# Altium schematic sheet mcu.SchDoc
size A3
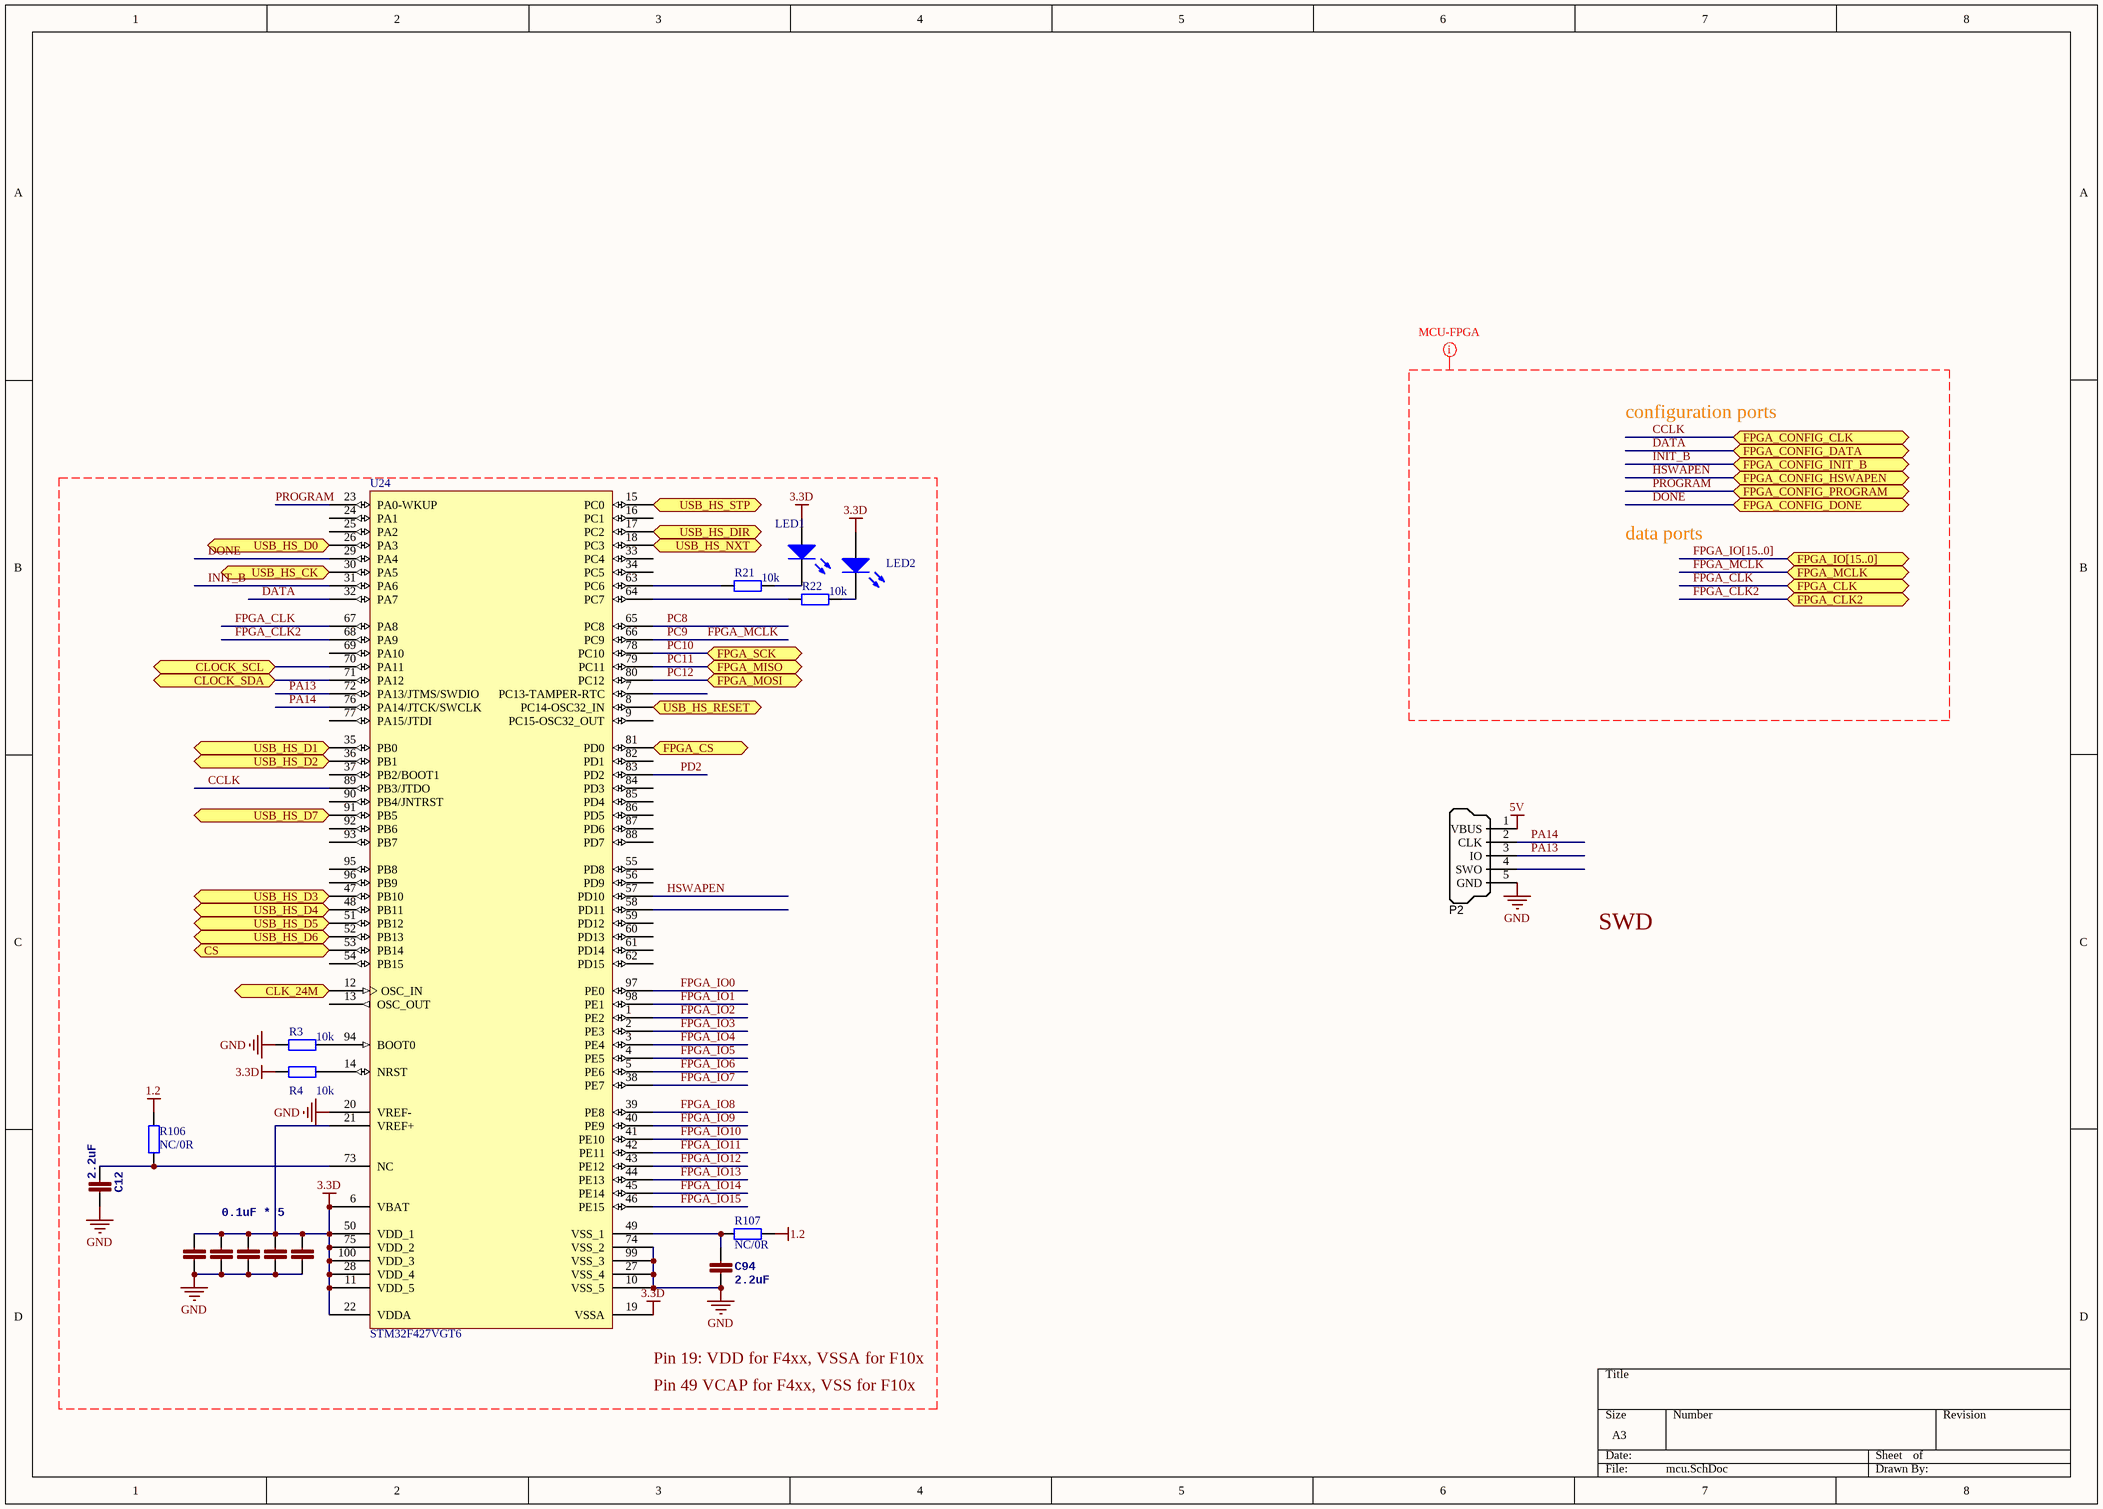
[diagram p0: mcu.SchDoc]

## Parts
C4  0.1uF * 5  [0402]
C5  1n  [0402]  (value not drawn)
C6  1n  [0402]  (value not drawn)
C10  1n  [0402]  (value not drawn)
C12  2.2uF  [0603]
C25  1n  [0402]  (value not drawn)
C94  2.2uF  [0603]
LED1  LED0  [0603]  (value not drawn)
LED2  LED0  [0603]  (value not drawn)
P2  SWD_MicroUSB  [MICRO-YZX]  (value not drawn)
R3  10k  [0402]
R4  10k  [0402]
R21  10k  [0402]
R22  10k  [0402]
R106  NC/0R  [0402]
R107  NC/0R  [0402]
U24  STM32F427VGT6  [LQFP100_N]

## Ports
CLK_24M, CLOCK_SCL, CLOCK_SDA, CS, FPGA_CLK, FPGA_CLK2, FPGA_CONFIG_CLK, FPGA_CONFIG_DATA, FPGA_CONFIG_DONE, FPGA_CONFIG_HSWAPEN, FPGA_CONFIG_INIT_B, FPGA_CONFIG_PROGRAM, FPGA_CS, FPGA_IO[15..0], FPGA_MCLK, FPGA_MISO, FPGA_MOSI, FPGA_SCK, USB_HS_CK, USB_HS_D0, USB_HS_D1, USB_HS_D2, USB_HS_D3, USB_HS_D4, USB_HS_D5, USB_HS_D6, USB_HS_D7, USB_HS_DIR, USB_HS_NXT, USB_HS_RESET, USB_HS_STP

## Nets
1.2: R106.1 R107.1
3.3D: C4.2 C5.2 C6.2 C10.2 C25.2 LED1.1(A) LED2.1(A) R4.2 U24.6(VBAT) U24.11(VDD_5) U24.19(VSSA) U24.21(VREF+) U24.22(VDDA) U24.28(VDD_4) U24.50(VDD_1) U24.75(VDD_2) U24.100(VDD_3)
5V: P2.1(VBUS)
GND: C4.1 C5.1 C6.1 C10.1 C12.1 C25.1 C94.1 P2.5(GND) R3.1 U24.10(VSS_5) U24.20(VREF-) U24.27(VSS_4) U24.74(VSS_2) U24.99(VSS_3)
CCLK: U24.89(PB3/JTDO) ; port FPGA_CONFIG_CLK
CLK_24M: U24.12(OSC_IN) ; port CLK_24M
CLOCK_SCL: U24.70(PA11) ; port CLOCK_SCL
CLOCK_SDA: U24.71(PA12) ; port CLOCK_SDA
CS: U24.53(PB14) ; port CS
DATA: U24.32(PA7) ; port FPGA_CONFIG_DATA
DONE: U24.29(PA4) ; port FPGA_CONFIG_DONE
FPGA_CLK: U24.67(PA8) ; port FPGA_CLK
FPGA_CLK2: U24.68(PA9) ; port FPGA_CLK2
FPGA_CS: U24.81(PD0) ; port FPGA_CS
FPGA_IO0: U24.97(PE0)
FPGA_IO1: U24.98(PE1)
FPGA_IO2: U24.1(PE2)
FPGA_IO3: U24.2(PE3)
FPGA_IO4: U24.3(PE4)
FPGA_IO5: U24.4(PE5)
FPGA_IO6: U24.5(PE6)
FPGA_IO7: U24.38(PE7)
FPGA_IO8: U24.39(PE8)
FPGA_IO9: U24.40(PE9)
FPGA_IO10: U24.41(PE10)
FPGA_IO11: U24.42(PE11)
FPGA_IO12: U24.43(PE12)
FPGA_IO13: U24.44(PE13)
FPGA_IO14: U24.45(PE14)
FPGA_IO15: U24.46(PE15)
FPGA_MCLK: U24.66(PC9) ; port FPGA_MCLK  [also labelled PC9]
HSWAPEN: U24.57(PD10) ; port FPGA_CONFIG_HSWAPEN
INIT_B: U24.31(PA6) ; port FPGA_CONFIG_INIT_B
PA13: P2.3(IO) U24.72(PA13/JTMS/SWDIO)
PA14: P2.2(CLK) U24.76(PA14/JTCK/SWCLK)
PC8: U24.65(PC8)
PC10: U24.78(PC10) ; port FPGA_SCK
PC11: U24.79(PC11) ; port FPGA_MISO
PC12: U24.80(PC12) ; port FPGA_MOSI
PD2: U24.83(PD2)
PROGRAM: U24.23(PA0-WKUP) ; port FPGA_CONFIG_PROGRAM
USB_HS_CK: U24.30(PA5) ; port USB_HS_CK
USB_HS_D0: U24.26(PA3) ; port USB_HS_D0
USB_HS_D1: U24.35(PB0) ; port USB_HS_D1
USB_HS_D2: U24.36(PB1) ; port USB_HS_D2
USB_HS_D3: U24.47(PB10) ; port USB_HS_D3
USB_HS_D4: U24.48(PB11) ; port USB_HS_D4
USB_HS_D5: U24.51(PB12) ; port USB_HS_D5
USB_HS_D6: U24.52(PB13) ; port USB_HS_D6
USB_HS_D7: U24.91(PB5) ; port USB_HS_D7
USB_HS_DIR: U24.17(PC2) ; port USB_HS_DIR
USB_HS_NXT: U24.18(PC3) ; port USB_HS_NXT
USB_HS_RESET: U24.8(PC14-OSC32_IN) ; port USB_HS_RESET
USB_HS_STP: U24.15(PC0) ; port USB_HS_STP
NetC12_2: C12.2 R106.2 U24.73(NC)
NetC94_2: C94.2 R107.2 U24.49(VSS_1)
NetLED1_2: LED1.2(K) R21.2
NetLED2_2: LED2.2(K) R22.2
NetR3_2: R3.2 U24.94(BOOT0)
NetR4_1: R4.1 U24.14(NRST)
NetR21_1: R21.1 U24.63(PC6)
NetR22_1: R22.1 U24.64(PC7)

Not connected (* = marked no-connect by the designer): P2 4(SWO); U24 7(PC13-TAMPER-RTC) 9(PC15-OSC32_OUT) 13(OSC_OUT) 16(PC1) 24(PA1) 25(PA2) 33(PC4) 34(PC5) 37(PB2/BOOT1) 54(PB15) 55(PD8) 56(PD9) 58(PD11) 59(PD12) 60(PD13) 61(PD14) 62(PD15) 69(PA10) 77(PA15/JTDI) 82(PD1) 84(PD3) 85(PD4) 86(PD5) 87(PD6) 88(PD7) 90(PB4/JNTRST) 92(PB6) 93(PB7) 95(PB8) 96(PB9)

## Buses and harness runs
bus FPGA_IO[15..0] = port FPGA_IO[15..0]

## Layout directives
net class MCU-FPGA: CCLK, DATA, DONE, FPGA_CLK, FPGA_CLK2, FPGA_IO[15..0], FPGA_MCLK, HSWAPEN, INIT_B, PROGRAM

## Notes on the sheet
- configuration ports
- data ports
- SWD
- Pin 19: VDD for F4xx, VSSA for F10x
- Pin 49 VCAP for F4xx, VSS for F10x

## Library data of the parts
C4-C6 C10 C12 C25 C94 = CAP0402-CAP: <b>Capacitor</b> / Standard 0603 ceramic capacitor, and 0.1" leaded capacitor.; PARTNO: CC0402ZRY5V7BB104
LED1 LED2 = LED0: Typical INFRARED GaAs LED; Published: 8-Jun-2000; LatestRevisionDate: 08-Jul-2005; LatestRevisionNote: Mech Layer 1 removed.; PackageReference: LED-0; Publisher: Altium Limited; PackageDescription: LED; 2 Leads
P2 = SWD_MicroUSB: Connector SMD USB Micro Type B middle mount; Manufacturer 1: Molex Inc; SCDType: undef; Package / Case: SMD; Supplier 1: Digi-Key; Supplier Part Number 1: WM17142CT-ND
R3 R4 R21 R22 R106 R107 = Res2: Resistor; Value: 0Ohm; Published: 8-Jun-2000; LatestRevisionDate: 17-Jul-2002; LatestRevisionNote: Re-released for DXP Platform.; PackageReference: AXIAL-0.4; Publisher: Altium Limited; PackageDescription: Axial Device, Thru-Hole; 2 Leads; 0.4 in Pin Spacing
U24 = STM32F103VBT6: STM32 ARM-based 32-bit MCU with 64 Kbytes Flash, 100-pin LQFP, Industrial Temperature; Published: *; DatasheetVersion: *; PackageVersion: *; PackageReference: *; Publisher: *; PackageDescription: *; ComponentLink1Description: *; ComponentLink1URL: *; ComponentLink2Description: *; ComponentLink2URL: *